# EasyEDA Pro project ProPrj_Inverted_MAML_6x6_2026-08-30.epro, schematic T20F256_FPGA
Create Date: 2026-07-20; Page Name: P1; Project Name: Inverted_MAML_6x6; Schematic Name: Schematic1; Update Date: 2026-07-20; Company: EasyEDA.com; Page Size: A4; Version: V1.0
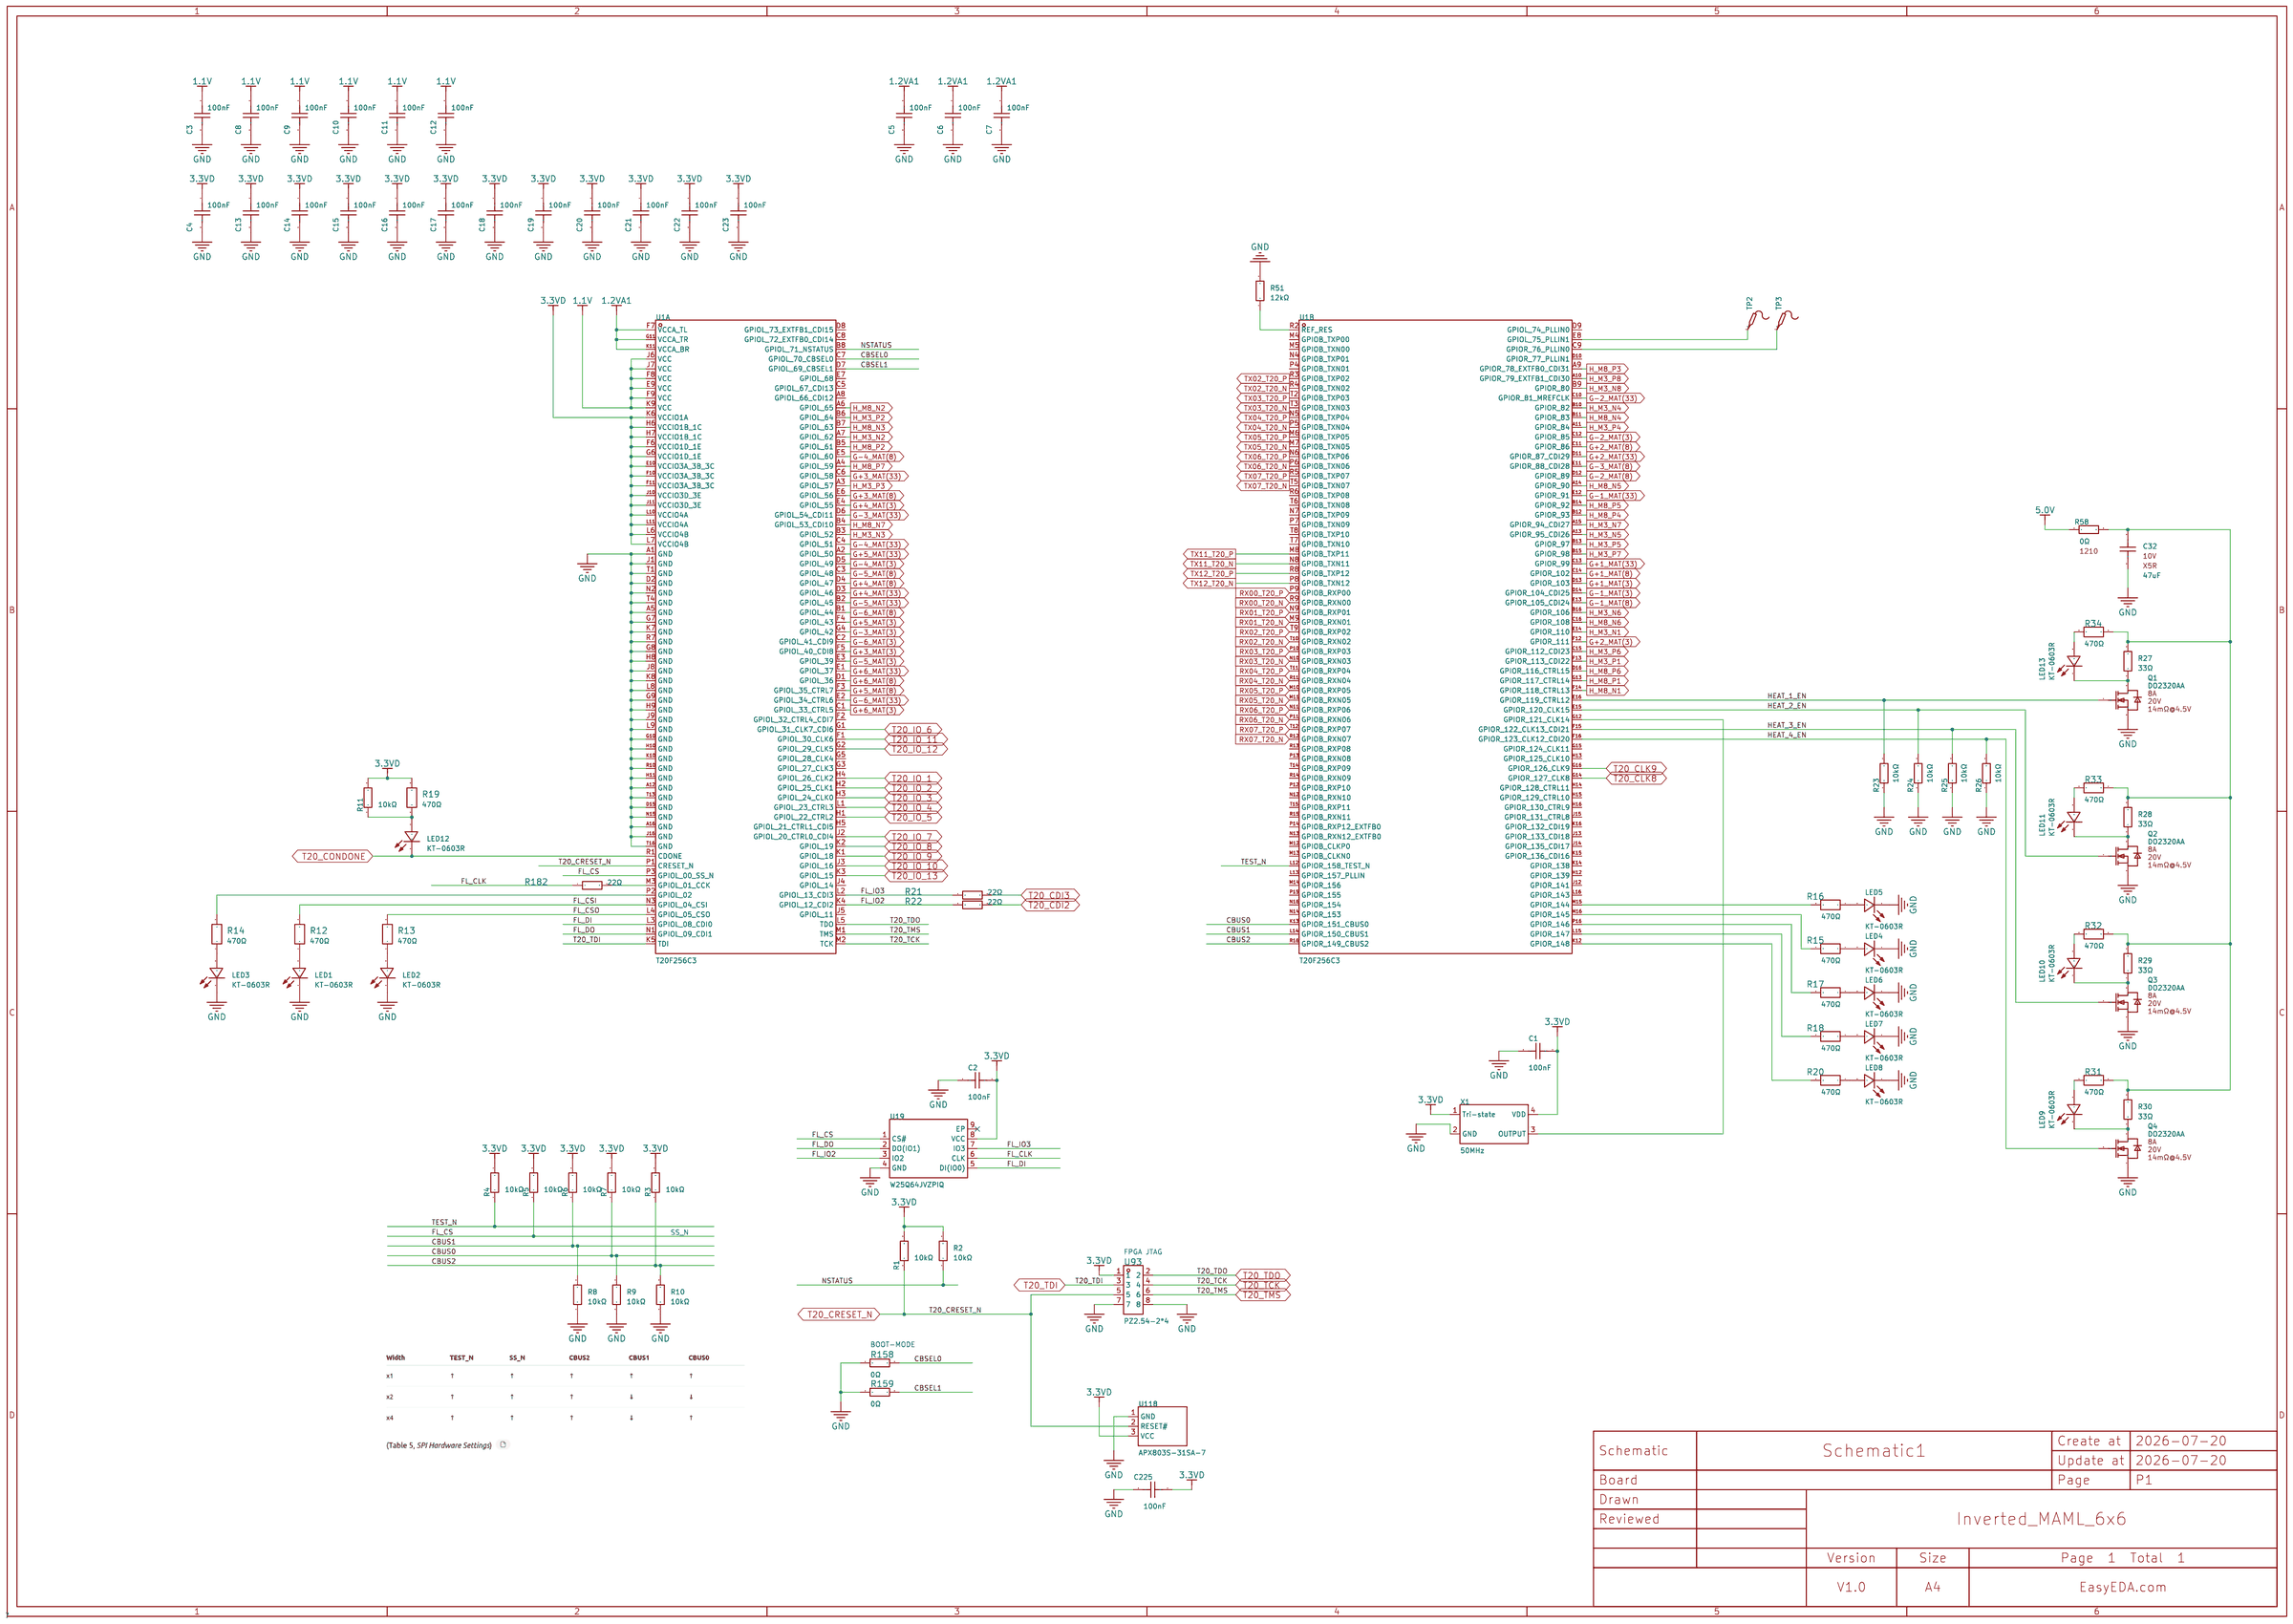
[diagram p0: schematic sheet]

## Parts
C1  100nF  [C0402]
C2  100nF  [C0402]
C3  100nF  [C0201]
C4  100nF  [C0201]
C5  100nF  [C0201]
C6  100nF  [C0201]
C7  100nF  [C0201]
C8  100nF  [C0201]
C9  100nF  [C0201]
C10  100nF  [C0201]
C11  100nF  [C0201]
C12  100nF  [C0201]
C13  100nF  [C0201]
C14  100nF  [C0201]
C15  100nF  [C0201]
C16  100nF  [C0201]
C17  100nF  [C0201]
C18  100nF  [C0201]
C19  100nF  [C0201]
C20  100nF  [C0201]
C21  100nF  [C0201]
C22  100nF  [C0201]
C23  100nF  [C0201]
C32  47uF  [C1206]
C225  100nF  [C0402]
LED1  KT-0603R  [LED0603-RD]
LED2  KT-0603R  [LED0603-RD]
LED3  KT-0603R  [LED0603-RD]
LED4  KT-0603R  [LED0603-RD]
LED5  KT-0603R  [LED0603-RD]
LED6  KT-0603R  [LED0603-RD]
LED7  KT-0603R  [LED0603-RD]
LED8  KT-0603R  [LED0603-RD]
LED9  KT-0603R  [LED0603-RD]
LED10  KT-0603R  [LED0603-RD]
LED11  KT-0603R  [LED0603-RD]
LED12  KT-0603R  [LED0603-RD]
LED13  KT-0603R  [LED0603-RD]
Q1  DO2320AA  [SOT-23-3_L2.9-W1.6-P1.90-LS2.8-BR]
Q2  DO2320AA  [SOT-23-3_L2.9-W1.6-P1.90-LS2.8-BR]
Q3  DO2320AA  [SOT-23-3_L2.9-W1.6-P1.90-LS2.8-BR]
Q4  DO2320AA  [SOT-23-3_L2.9-W1.6-P1.90-LS2.8-BR]
R1  10kΩ  [R0402]
R2  10kΩ  [R0402]
R3  10kΩ  [R0402]
R4  10kΩ  [R0402]
R5  10kΩ  [R0402]
R6  10kΩ  [R0402]
R7  10kΩ  [R0402]
R8  10kΩ  [R0402]  (no BOM)
R9  10kΩ  [R0402]  (no BOM)
R10  10kΩ  [R0402]  (no BOM)
R11  10kΩ  [R0402]
R12  470Ω  [R0402]
R13  470Ω  [R0402]
R14  470Ω  [R0402]
R15  470Ω  [R0402]
R16  470Ω  [R0402]
R17  470Ω  [R0402]
R18  470Ω  [R0402]
R19  470Ω  [R0402]
R20  470Ω  [R0402]
R21  22Ω  [R0402]
R22  22Ω  [R0402]
R23  10kΩ  [R0402]
R24  10kΩ  [R0402]
R25  10kΩ  [R0402]
R26  10kΩ  [R0402]
R27  33Ω  [R2512]
R28  33Ω  [R2512]
R29  33Ω  [R2512]
R30  33Ω  [R2512]
R31  470Ω  [R0402]
R32  470Ω  [R0402]
R33  470Ω  [R0402]
R34  470Ω  [R0402]
R51  12kΩ  [R0402]
R58  0Ω  [R1210]
R158  0Ω  [R0402]
R159  0Ω  [R0402]
R182  22Ω  [R0402]
TP2  -  [Test-Point-0.5mm]
TP3  -  [Test-Point-0.5mm]
U1  T20F256C3  [FBGA-256_L13.0-W13.0-R16-C16-P0.80-TL]  (sections 1,2)
U19  W25Q64JVZPIQ  [WSON-8_L6.0-W5.0-P1.27-BL-EP]
U93  PZ2.54-2*4  [HDR-TH_8P-P2.54-V-M-R2-C4-S2.54]
U118  APX803S-31SA-7  [SOT-23-3_L2.9-W1.3-P1.90-LS2.4-BR]
X1  50MHz  [OSC-SMD_4P-L3.2-W2.5-BL]

## Library data of the parts
C1 C2 C225 = CL05B104KB54PNC: Capacitance: Tolerance:±10% Tolerance:±10% Voltage Rated: Temperature Coefficient:; LCSC Part Name: 100nF ±10% 50V; Supplier Part: C307331; Manufacturer: SAMSUNG(三星); Supplier Footprint: 0402; JLCPCB Part Class: Basic Part; Datasheet: https://atta.szlcsc.com/upload/public/pdf/source/20160218/1457707763339.pdf; Supplier: LCSC; Tolerance: ±10%; Check: true
C3-C23 = CL03A104KP3NNNC: Capacitance:100nF Tolerance:±10% Tolerance:±10% Voltage Rating:10V Temperature Coefficient:X5R; LCSC Part Name: 100nF ±10% 10V; Supplier Part: C49062; Manufacturer: SAMSUNG(三星); Supplier Footprint: 0201; JLCPCB Part Class: Extended Part; Datasheet: https://item.szlcsc.com/datasheet/CL03A104KP3NNNC/50070.html; Supplier: LCSC; Tolerance: ±10%; Voltage Rating: 10V; Temperature Coefficient: X5R
C32 = CL31A476MPHNNNE: Capacitance:47uF Tolerance:±20% Tolerance:±20% Voltage Rating:10V Temperature Coefficient:X5R; LCSC Part Name: 47uF ±20% 10V; Supplier Part: C96123; Manufacturer: SAMSUNG(三星); Supplier Footprint: 1206; JLCPCB Part Class: Basic Part; Datasheet: https://item.szlcsc.com/datasheet/CL31A476MPHNNNE/97327.html; Supplier: LCSC; Tolerance: ±20%; Voltage Rating: 10V; Temperature Coefficient: X5R
LED1-LED13 = KT-0603R: Emitted Color:Red Power Dissipation:- Forward Current:- Dominant Wavelength:- Dominant Wavelength:- Peak Wavelength:- Diode Configuration:- Lens Color:- Color Temperature:- Color Temperature:- Viewing Angle:- Mounting Sytle:- Operating Temperature:-40℃~+8; LCSC Part Name: 0603 红灯 高亮; Supplier Part: C2286; Manufacturer: KENTO; Supplier Footprint: 0603; JLCPCB Part Class: Basic Part; Datasheet: https://atta.szlcsc.com/upload/public/pdf/source/20160616/1466072038404.pdf; Supplier: LCSC; Emitted Color: Red; Operating Temperature: -40℃~+85℃
Q1-Q4 = DO2320AA: Drain to Source Voltage:20V Current - Continuous Drain(Id):8A RDS(on):14mΩ@4.5V Pd - Power Dissipation:1.5W Gate Threshold Voltage (Vgs(th)):1.2V@250uA Gate Charge(Qg):15nC@4.5V Input Capacitance(Ciss):950pF@10V Reverse Transfer Capacitance (Crss@Vds):155; LCSC Part Name: N沟道MOSFET; Supplier Part: C47018574; Manufacturer: DOINGTER(杜因特); Supplier Footprint: SOT-23-3; JLCPCB Part Class: Extended Part; Datasheet: https://item.szlcsc.com/datasheet/DO2320AA/49200340.html; Supplier: LCSC; Drain to Source Voltage: 20V; Current - Continuous Drain(Id): 8A; RDS(on): 14mΩ@4.5V; Pd - Power Dissipation: 1.5W; Gate Threshold Voltage (Vgs(th)): 1.2V@250uA; Gate Charge(Qg): 15nC@4.5V; Input Capacitance(Ciss): 950pF@10V; Reverse Transfer Capacitance (Crss@Vds): 155pF@10V; Operating Temperature: -55℃~+150℃; Type: N-Channel; Output Capacitance(Coss): 175pF
R1-R11 R23-R26 = 0402WGF1002TCE: Type:Thick Film Resistors Resistance:10kΩ Tolerance:±1% Tolerance:±1% Power(Watts): Overload Voltage (Max): Temperature Coefficient:±100ppm/℃ Temperature Coefficient:±100ppm/℃ Operating Temperature Range:-55℃~+155℃ Operating Temperature Range:-55℃~+155℃; LCSC Part Name: 10kΩ ±1% 62.5mW 厚膜电阻; Supplier Part: C25744; Manufacturer: UNI-ROYAL(厚声); Supplier Footprint: 0402; JLCPCB Part Class: Basic Part; Datasheet: https://atta.szlcsc.com/upload/public/pdf/source/20200306/C422600_1E6D84923E4A46A82E41ADD87F860B5C.pdf; Supplier: LCSC; Type: Thick Film Resistors; Tolerance: ±1%; Temperature Coefficient: ±100ppm/℃; Operating Temperature Range: -55℃~+155℃
R12-R20 R31-R34 = 0402WGF4700TCE: Type:Thick Film Resistors Resistance: Tolerance:±1% Tolerance:±1% Power(Watts): Overload Voltage (Max): Temperature Coefficient:±100ppm/℃ Temperature Coefficient:±100ppm/℃ Operating Temperature Range:-55℃~+155℃ Operating Temperature Range:-55℃~+155℃; LCSC Part Name: 470Ω ±1% 62.5mW 厚膜电阻; Supplier Part: C25117; Manufacturer: UNI-ROYAL(厚声); Supplier Footprint: 0402; JLCPCB Part Class: Basic Part; Datasheet: https://atta.szlcsc.com/upload/public/pdf/source/20200306/C422600_1E6D84923E4A46A82E41ADD87F860B5C.pdf; Supplier: LCSC; Type: Thick Film Resistors; Tolerance: ±1%; Temperature Coefficient: ±100ppm/℃; Operating Temperature Range: -55℃~+155℃
R21 R22 R182 = 0402WGF220JTCE: Type:Thick Film Resistors Resistance:22Ω Tolerance:±1% Tolerance:±1% Power(Watts): Overload Voltage (Max): Temperature Coefficient:±100ppm/℃ Temperature Coefficient:±100ppm/℃ Operating Temperature Range:-55℃~+155℃ Operating Temperature Range:-55℃~+155℃; LCSC Part Name: 22Ω ±1% 62.5mW 厚膜电阻; Supplier Part: C25092; Manufacturer: UNI-ROYAL(厚声); Supplier Footprint: 0402; JLCPCB Part Class: Basic Part; Datasheet: https://atta.szlcsc.com/upload/public/pdf/source/20200306/C422600_1E6D84923E4A46A82E41ADD87F860B5C.pdf; Supplier: LCSC; Type: Thick Film Resistors; Tolerance: ±1%; Temperature Coefficient: ±100ppm/℃; Operating Temperature Range: -55℃~+155℃
R27-R30 = CRH2512F33R0E04Z: Type:Thick Film Resistor Resistance:33Ω Tolerance:±1% Tolerance:±1% Power(Watts):2W Voltage-Supply(Max):200V Temperature Coefficient:±100ppm/℃ Temperature Coefficient:±100ppm/℃ Operating Temperature:-55℃~+155℃ Operating Temperature:-55℃~+155℃; LCSC Part Name: 厚膜电阻 33Ω ±1% 2W; Supplier Part: C175260; Manufacturer: EVER OHMS(天二科技); Supplier Footprint: 2512; JLCPCB Part Class: Extended Part; Datasheet: https://item.szlcsc.com/datasheet/CRH2512F33R0E04Z/186650.html; Supplier: LCSC; Type: Thick Film Resistor; Tolerance: ±1%; Power(Watts): 2W; Voltage-Supply(Max): 200V; Temperature Coefficient: ±100ppm/℃; Operating Temperature: -55℃~+155℃
R51 = 0402WGF1202TCE: Type:Thick Film Resistor Resistance:12kΩ Tolerance:±1% Tolerance:±1% Power(Watts):62.5mW Voltage-Supply(Max):50V Temperature Coefficient:±100ppm/℃ Temperature Coefficient:±100ppm/℃ Operating Temperature:-55℃~+155℃ Operating Temperature:-55℃~+155℃; LCSC Part Name: 12kΩ ±1% 62.5mW 厚膜电阻; Supplier Part: C25752; Manufacturer: UNI-ROYAL(厚声); Supplier Footprint: 0402; JLCPCB Part Class: Basic Part; Datasheet: https://item.szlcsc.com/datasheet/0402WGF1202TCE/26495.html; Supplier: LCSC; Type: Thick Film Resistor; Tolerance: ±1%; Power(Watts): 62.5mW; Voltage-Supply(Max): 50V; Temperature Coefficient: ±100ppm/℃; Operating Temperature: -55℃~+155℃
R58 = RS-1210000JT: Type:Thick Film Resistors Resistance:0Ω Tolerance:±5% Tolerance:±5% Power(Watts):1/3W Voltage-Supply(Max):200V Operating Temperature:-55℃~+155℃ Operating Temperature:-55℃~+155℃; LCSC Part Name: 厚膜电阻 0Ω ±5% 333.333mW; Supplier Part: C140000; Manufacturer: FH(风华); Supplier Footprint: 1210; JLCPCB Part Class: Extended Part; Datasheet: https://atta.szlcsc.com/upload/public/pdf/source/20140616/1457707091974.pdf; Supplier: LCSC; Type: Thick Film Resistors; Tolerance: ±5%; Power(Watts): 1/3W; Voltage-Supply(Max): 200V; Operating Temperature: -55℃~+155℃
R158 R159 = 0402WGF0000TCE: Type:Thick Film Resistor Resistance:0Ω Tolerance:±1% Tolerance:±1% Power(Watts):62.5mW Voltage-Supply(Max):50V Temperature Coefficient:±800ppm/℃ Temperature Coefficient:±800ppm/℃ Operating Temperature:-55℃~+155℃ Operating Temperature:-55℃~+155℃; LCSC Part Name: 0Ω ±1% 62.5mW 厚膜电阻; Supplier Part: C17168; Manufacturer: UNI-ROYAL(厚声); Supplier Footprint: 0402; JLCPCB Part Class: Basic Part; Datasheet: https://item.szlcsc.com/datasheet/0402WGF0000TCE/17853.html; Supplier: LCSC; Type: Thick Film Resistor; Tolerance: ±1%; Power(Watts): 62.5mW; Voltage-Supply(Max): 50V; Temperature Coefficient: ±800ppm/℃; Operating Temperature: -55℃~+155℃
TP2 TP3 = Test-Point: Test Point 测试点
U1 = T20F256C3: Type:- Voltage - Supply(VCCIO):- Voltage - Supply(VCCIO):- Number of Logic Elements/Blocks:19728 Logic Array Blocks:- Embedded Block RAM:1069548bit Operating Temperature:0℃~+85℃ Operating Temperature:0℃~+85℃; Supplier Part: C3277960; Manufacturer: Efinix; Supplier Footprint: FBGA-256(13x13); JLCPCB Part Class: Extended Part; Datasheet: https://atta.szlcsc.com/upload/public/pdf/source/231023/trion20-ds-v4.3.pdf-f424e73107ecd1985512a57dd8500c50.pdf; Supplier: LCSC; Number of Logic Elements/Blocks: 19728; Embedded Block RAM: 1069548bit; Operating Temperature: 0℃~+85℃
U19 = W25Q64JVZPIQ: Interface Type:SPI Memory Size:64Mbit Clock Frequency (fc):133MHz Supply Voltage:2.7V~3.6V Supply Voltage:2.7V~3.6V Page Programming Time (Tpp):400us Block Erase Time (tBE):120ms@(32KB) Data Retention - TDR (Year):20 years Operating Temperature:-40℃~+85℃; Supplier Part: C2940197; Manufacturer: WINBOND(华邦); Supplier Footprint: WSON-8-EP(5x6); JLCPCB Part Class: Extended Part; Datasheet: https://atta.szlcsc.com/upload/public/pdf/source/20220111/96C134BA110DAC08742B3CB6C4519B4C.pdf; Supplier: LCSC; Interface Type: SPI; Memory Size: 64Mbit; Clock Frequency (fc): 133MHz; Supply Voltage: 2.7V~3.6V; Page Programming Time (Tpp): 400us; Block Erase Time (tBE): 120ms@(32KB); Data Retention - TDR (Year): 20 years; Operating Temperature: -40℃~+85℃; Check: true
U93 = PZ2.54-2*4: Pin Structure:2x4P Pitch:2.54mm Number of Rows:双排 Number of Pins:8P; Supplier Part: C5156676; Manufacturer: ZHOURI(洲日); Supplier Footprint: 插件,P=2.54mm; JLCPCB Part Class: Extended Part; Datasheet: https://atta.szlcsc.com/upload/public/pdf/source/20220923/0E7A4A94740FFD503E2D73F36F92C1EA.pdf; Supplier: LCSC; Pin Structure: 2x4P; Pitch: 2.54mm; Number of Rows: 双排; Number of Pins: 8P; Check: true
U118 = APX803S-31SA-7: ChipType:Voltage Monitor Output Type:Open Drain Voltage - Supply:1V~5.5V Voltage - Supply:1V~5.5V Reset Active Level:Active Low Threshold Voltage:3.08V Number of Voltages Monitored:1 Manual Reset:No Watchdog:No Reset Timeout:240ms Operating Temperature:-4; LCSC Part Name: 3引脚微处理器复位电路; Supplier Part: C129757; Manufacturer: DIODES(美台); Supplier Footprint: SOT-23; JLCPCB Part Class: Extended Part; Datasheet: https://item.szlcsc.com/datasheet/APX803S-31SA-7/141043.html; Supplier: LCSC; ChipType: Voltage Monitor; Output Type: Open Drain; Voltage - Supply: 1V~5.5V; Reset Active Level: Active Low; Threshold Voltage: 3.08V; Number of Voltages Monitored: 1; Manual Reset: No; Watchdog: No; Reset Timeout: 240ms; Operating Temperature: -40℃~+85℃
X1 = OT322550MJBA4SL: Frequency:50MHz Normal temperature Frequency Tolerance:±10ppm Normal temperature Frequency Tolerance:±10ppm Output Type:CMOS Voltage - Supply:1.8V~3.3V Voltage - Supply:1.8V~3.3V Frequency Stability:±20ppm Frequency Stability:±20ppm Operating Temperature:; LCSC Part Name: YSO110TR 50MHZ 4P 3225 1.8V-3.3V ±10PPM -40~85℃ (±20PPM) CMOS; Supplier Part: C717684; Manufacturer: YXC(扬兴晶振); Supplier Footprint: SMD3225-4P; JLCPCB Part Class: Extended Part; Datasheet: https://item.szlcsc.com/datasheet/OT322550MJBA4SL/758644.html; Supplier: LCSC; Normal temperature Frequency Tolerance: ±10ppm; Output Type: CMOS; Voltage - Supply: 1.8V~3.3V; Frequency Stability: ±20ppm; Operating Temperature: -40℃~+85℃

## Nets
1.1V: C3.1 C8.1 C9.1 C10.1 C11.1 C12.1 U1.E9(VCC) U1.F8(VCC) U1.F9(VCC) U1.J6(VCC) U1.J7(VCC) U1.K9(VCC)
1.2VA1: C5.1 C6.1 C7.1 U1.F7(VCCA_TL) U1.G11(VCCA_TR) U1.K11(VCCA_BR)
3.3VD: C1.1 C2.1 C4.1 C13.1 C14.1 C15.1 C16.1 C17.1 C18.1 C19.1 C20.1 C21.1 C22.1 C23.1 C225.1 R1.2 R2.2 R3.2 R4.2 R5.2 R6.2 R7.2 R11.2 R19.2 U1.E10(VCCIO3A_3B_3C) U1.F6(VCCIO1D_1E) U1.F10(VCCIO3A_3B_3C) U1.F11(VCCIO3A_3B_3C) U1.G6(VCCIO1D_1E) U1.H6(VCCIO1B_1C) U1.H7(VCCIO1B_1C) U1.J10(VCCIO3D_3E) U1.J11(VCCIO3D_3E) U1.K6(VCCIO1A) U1.L6(VCCIO4B) U1.L7(VCCIO4B) U1.L10(VCCIO4A) U1.L11(VCCIO4A) U19.8(VCC) U93.1 U118.3(VCC) X1.1(Tri-state) X1.4(VDD)
5.0V: R58.1
GND: C1.2 C2.2 C3.2 C4.2 C5.2 C6.2 C7.2 C8.2 C9.2 C10.2 C11.2 C12.2 C13.2 C14.2 C15.2 C16.2 C17.2 C18.2 C19.2 C20.2 C21.2 C22.2 C23.2 C32.1 C225.2 LED1.1(K) LED2.1(K) LED3.1(K) LED4.1(K) LED5.1(K) LED6.1(K) LED7.1(K) LED8.1(K) Q1.2(S) Q2.2(S) Q3.2(S) Q4.2(S) R8.1 R9.1 R10.1 R23.1 R24.1 R25.1 R26.1 R51.2 R158.1 R159.1 U1.A1(GND) U1.A5(GND) U1.A12(GND) U1.A16(GND) U1.D2(GND) U1.D15(GND) U1.G7(GND) U1.G8(GND) U1.G9(GND) U1.G10(GND) U1.H8(GND) U1.H9(GND) U1.H10(GND) U1.H11(GND) U1.J1(GND) U1.J8(GND) U1.J9(GND) U1.J16(GND) U1.K7(GND) U1.K8(GND) U1.K10(GND) U1.L8(GND) U1.L9(GND) U1.N2(GND) U1.N15(GND) U1.R7(GND) U1.R10(GND) U1.T1(GND) U1.T4(GND) U1.T13(GND) U1.T16(GND) U19.4(GND) U93.7 U93.8 U118.1(GND) X1.2(GND)
CBSEL0: R158.2 U1.C7(GPIOL_70_CBSEL0)
CBSEL1: R159.2 U1.D7(GPIOL_69_CBSEL1)
CBUS0: R7.1 R9.2 U1.K13(GPIOR_151_CBUS0)
CBUS1: R6.1 R8.2 U1.L14(GPIOR_150_CBUS1)
CBUS2: R3.1 R10.2 U1.R16(GPIOR_149_CBUS2)
FL_CLK: R182.1 U19.6(CLK)
FL_CS: R5.1 U1.P3(GPIOL_00_SS_N) U19.1(CS#)
FL_CSI: R12.2 U1.N3(GPIOL_04_CSI)
FL_CSO: R13.2 U1.L4(GPIOL_05_CSO)
FL_DI: U1.L3(GPIOL_08_CDI0) U19.5(DI(IO0))
FL_DO: U1.N1(GPIOL_09_CDI1) U19.2(DO(IO1))
FL_IO2: R22.1 U1.K4(GPIOL_12_CDI2) U19.3(IO2)
FL_IO3: R21.1 U1.L2(GPIOL_13_CDI3) U19.7(IO3)
G+1_MAT(3): U1.D13(GPIOR_103)
G+1_MAT(8): U1.C14(GPIOR_102)
G+1_MAT(33): U1.C13(GPIOR_99)
G+2_MAT(3): U1.F12(GPIOR_111)
G+2_MAT(8): U1.C11(GPIOR_86)
G+2_MAT(33): U1.D11(GPIOR_87_CDI29)
G+3_MAT(3): U1.F5(GPIOL_40_CDI8)
G+3_MAT(8): U1.E6(GPIOL_56)
G+3_MAT(33): U1.C6(GPIOL_58)
G+4_MAT(3): U1.E4(GPIOL_55)
G+4_MAT(8): U1.D4(GPIOL_47)
G+4_MAT(33): U1.D3(GPIOL_46)
G+5_MAT(3): U1.F4(GPIOL_43)
G+5_MAT(8): U1.F3(GPIOL_35_CTRL7)
G+5_MAT(33): U1.A2(GPIOL_50)
G+6_MAT(3): U1.C1(GPIOL_33_CTRL5)
G+6_MAT(8): U1.D1(GPIOL_36)
G+6_MAT(33): U1.E1(GPIOL_37)
G-1_MAT(3): U1.D14(GPIOR_104_CDI25)
G-1_MAT(8): U1.E13(GPIOR_105_CDI24)
G-1_MAT(33): U1.E12(GPIOR_91)
G-2_MAT(3): U1.C12(GPIOR_85)
G-2_MAT(8): U1.D12(GPIOR_89)
G-2_MAT(33): U1.C10(GPIOR_81_MREFCLK)
G-3_MAT(3): U1.G4(GPIOL_42)
G-3_MAT(8): U1.E11(GPIOR_88_CDI28)
G-3_MAT(33): U1.D6(GPIOL_54_CDI11)
G-4_MAT(3): U1.D5(GPIOL_49)
G-4_MAT(8): U1.E5(GPIOL_60)
G-4_MAT(33): U1.C4(GPIOL_51)
G-5_MAT(3): U1.E3(GPIOL_39)
G-5_MAT(8): U1.C3(GPIOL_48)
G-5_MAT(33): U1.B2(GPIOL_45)
G-6_MAT(3): U1.C2(GPIOL_41_CDI9)
G-6_MAT(8): U1.B1(GPIOL_44)
G-6_MAT(33): U1.E2(GPIOL_34_CTRL6)
H_M3_N1: U1.E14(GPIOR_110)
H_M3_N2: U1.A7(GPIOL_62)
H_M3_N3: U1.B3(GPIOL_52)
H_M3_N4: U1.B10(GPIOR_82)
H_M3_N5: U1.A13(GPIOR_95_CDI26)
H_M3_N6: U1.B16(GPIOR_106)
H_M3_N7: U1.A15(GPIOR_94_CDI27)
H_M3_N8: U1.B9(GPIOR_80)
H_M3_P1: U1.F13(GPIOR_113_CDI22)
H_M3_P2: U1.B6(GPIOL_64)
H_M3_P3: U1.A3(GPIOL_57)
H_M3_P4: U1.A11(GPIOR_84)
H_M3_P5: U1.B13(GPIOR_97)
H_M3_P6: U1.C15(GPIOR_112_CDI23)
H_M3_P7: U1.B15(GPIOR_98)
H_M3_P8: U1.A10(GPIOR_79_EXTFB1_CDI30)
H_M8_N1: U1.F14(GPIOR_118_CTRL13)
H_M8_N2: U1.A6(GPIOL_65)
H_M8_N3: U1.B7(GPIOL_63)
H_M8_N4: U1.B11(GPIOR_83)
H_M8_N5: U1.A14(GPIOR_90)
H_M8_N6: U1.C16(GPIOR_108)
H_M8_N7: U1.B4(GPIOL_53_CDI10)
H_M8_P1: U1.G13(GPIOR_117_CTRL14)
H_M8_P2: U1.B5(GPIOL_61)
H_M8_P3: U1.A9(GPIOR_78_EXTFB0_CDI31)
H_M8_P4: U1.B12(GPIOR_93)
H_M8_P5: U1.B14(GPIOR_92)
H_M8_P6: U1.D16(GPIOR_116_CTRL15)
H_M8_P7: U1.A4(GPIOL_59)
HEAT_1_EN: Q1.1(G) R23.2 U1.E16(GPIOR_119_CTRL12)
HEAT_2_EN: Q2.1(G) R24.2 U1.E15(GPIOR_120_CLK15)
HEAT_3_EN: Q3.1(G) R25.2 U1.F15(GPIOR_122_CLK13_CDI21)
HEAT_4_EN: Q4.1(G) R26.2 U1.F16(GPIOR_123_CLK12_CDI20)
NSTATUS: R2.1 U1.B8(GPIOL_71_NSTATUS)
RX00_T20_N: U1.R9(GPIOB_RXN00)
RX00_T20_P: U1.P9(GPIOB_RXP00)
RX01_T20_N: U1.M9(GPIOB_RXN01)
RX01_T20_P: U1.N9(GPIOB_RXP01)
RX02_T20_N: U1.T10(GPIOB_RXN02)
RX02_T20_P: U1.T9(GPIOB_RXP02)
RX03_T20_N: U1.N10(GPIOB_RXN03)
RX03_T20_P: U1.P10(GPIOB_RXP03)
RX04_T20_N: U1.R11(GPIOB_RXN04)
RX04_T20_P: U1.T11(GPIOB_RXP04)
RX05_T20_N: U1.M11(GPIOB_RXN05)
RX05_T20_P: U1.M10(GPIOB_RXP05)
RX06_T20_N: U1.P11(GPIOB_RXN06)
RX06_T20_P: U1.N11(GPIOB_RXP06)
RX07_T20_N: U1.R12(GPIOB_RXN07)
RX07_T20_P: U1.T12(GPIOB_RXP07)
T20_CDI2: R22.2
T20_CDI3: R21.2
T20_CLK8: U1.G14(GPIOR_127_CLK8)
T20_CLK9: U1.G16(GPIOR_126_CLK9)
T20_CONDONE: LED12.1(K) U1.R1(CDONE)
T20_CRESET_N: R1.1 U1.P1(CRESET_N) U93.5 U118.2(RESET#)
T20_IO_1: U1.H4(GPIOL_26_CLK2)
T20_IO_2: U1.H2(GPIOL_25_CLK1)
T20_IO_3: U1.H3(GPIOL_24_CLK0)
T20_IO_4: U1.L1(GPIOL_23_CTRL3)
T20_IO_5: U1.H1(GPIOL_22_CTRL2)
T20_IO_6: U1.G1(GPIOL_31_CLK7_CDI6)
T20_IO_7: U1.J2(GPIOL_20_CTRL0_CDI4)
T20_IO_8: U1.K2(GPIOL_19)
T20_IO_9: U1.K1(GPIOL_18)
T20_IO_10: U1.J3(GPIOL_16)
T20_IO_11: U1.F1(GPIOL_30_CLK6)
T20_IO_12: U1.G2(GPIOL_29_CLK5)
T20_IO_13: U1.K3(GPIOL_15)
T20_TCK: U1.M2(TCK) U93.4
T20_TDI: U1.K5(TDI) U93.3
T20_TDO: U1.L5(TDO) U93.2
T20_TMS: U1.M1(TMS) U93.6
TEST_N: R4.1 U1.L12(GPIOR_158_TEST_N)
TX02_T20_N: U1.R4(GPIOB_TXN02)
TX02_T20_P: U1.R3(GPIOB_TXP02)
TX03_T20_N: U1.T3(GPIOB_TXN03)
TX03_T20_P: U1.T2(GPIOB_TXP03)
TX04_T20_N: U1.P5(GPIOB_TXN04)
TX04_T20_P: U1.N5(GPIOB_TXP04)
TX05_T20_N: U1.M7(GPIOB_TXN05)
TX05_T20_P: U1.M6(GPIOB_TXP05)
TX06_T20_N: U1.P6(GPIOB_TXN06)
TX06_T20_P: U1.N6(GPIOB_TXP06)
TX07_T20_N: U1.T5(GPIOB_TXN07)
TX07_T20_P: U1.R5(GPIOB_TXP07)
TX11_T20_N: U1.N8(GPIOB_TXN11)
TX11_T20_P: U1.M8(GPIOB_TXP11)
TX12_T20_N: U1.P8(GPIOB_TXN12)
TX12_T20_P: U1.R8(GPIOB_TXP12)
Net-(C32-2): C32.2 R27.2 R28.2 R29.2 R30.2 R31.1 R32.1 R33.1 R34.1 R58.2
Net-(LED1-2): LED1.2(A) R12.1
Net-(LED2-2): LED2.2(A) R13.1
Net-(LED3-2): LED3.2(A) R14.1
Net-(LED4-2): LED4.2(A) R15.1
Net-(LED5-2): LED5.2(A) R16.1
Net-(LED6-2): LED6.2(A) R17.1
Net-(LED7-2): LED7.2(A) R18.1
Net-(LED8-2): LED8.2(A) R20.1
Net-(LED9-1): LED9.1(K) Q4.3(D) R30.1
Net-(LED9-2): LED9.2(A) R31.2
Net-(LED10-1): LED10.1(K) Q3.3(D) R29.1
Net-(LED10-2): LED10.2(A) R32.2
Net-(LED11-1): LED11.1(K) Q2.3(D) R28.1
Net-(LED11-2): LED11.2(A) R33.2
Net-(LED12-2): LED12.2(A) R11.1 R19.1
Net-(LED13-1): LED13.1(K) Q1.3(D) R27.1
Net-(LED13-2): LED13.2(A) R34.2
Net-(R14-2): R14.2 U1.P2(GPIOL_02)
Net-(R15-2): R15.2 U1.M16(GPIOR_145)
Net-(R16-2): R16.2 U1.M15(GPIOR_144)
Net-(R17-2): R17.2 U1.P16(GPIOR_146)
Net-(R18-2): R18.2 U1.L15(GPIOR_147)
Net-(R20-2): R20.2 U1.K12(GPIOR_148)
Net-(R51-1): R51.1 U1.R2(REF_RES)
Net-(R182-2): R182.2 U1.M3(GPIOL_01_CCK)
Net-(TP2-1): TP2.1 U1.E8(GPIOL_75_PLLIN1)
Net-(TP3-1): TP3.1 U1.C9(GPIOR_76_PLLIN0)
Net-(U1-G12): U1.G12(GPIOR_121_CLK14) X1.3(OUTPUT)

Not connected (* = marked no-connect by the designer): U1 A8(GPIOL_66_CDI12) C5(GPIOL_67_CDI13) C8(GPIOL_72_EXTFB0_CDI14) D8(GPIOL_73_EXTFB1_CDI15) D9(GPIOL_74_PLLIN0) D10(GPIOR_77_PLLIN1) E7(GPIOL_68) F2(GPIOL_32_CTRL4_CDI7) G3(GPIOL_27_CLK3) G5(GPIOL_28_CLK4) G15(GPIOR_124_CLK11) H5(GPIOL_21_CTRL1_CDI5) H12(GPIOR_139) H13(GPIOR_125_CLK10) H14(GPIOR_128_CTRL11) H15(GPIOR_129_CTRL10) H16(GPIOR_130_CTRL9) J4(GPIOL_14) J5(GPIOL_11) J12(GPIOR_141) J13(GPIOR_133_CDI18) J14(GPIOR_135_CDI17) J15(GPIOR_131_CTRL8) K14(GPIOR_138) K15(GPIOR_136_CDI16) K16(GPIOR_132_CDI19) L13(GPIOR_157_PLLIN) L16(GPIOR_143) M4(GPIOB_TXP00) M5(GPIOB_TXN00) M12(GPIOB_CLKP0) M13(GPIOB_CLKN0) M14(GPIOR_156) N4(GPIOB_TXP01) N7(GPIOB_TXP09) N12(GPIOB_RXN10) N13(GPIOB_RXN12_EXTFB0) N14(GPIOR_153) N16(GPIOR_154) P4(GPIOB_TXN01) P7(GPIOB_TXN09) P12(GPIOB_RXP10) P13(GPIOB_RXN08) P14(GPIOB_RXP12_EXTFB0) P15(GPIOR_155) R6(GPIOB_TXP08) R13(GPIOB_RXP08) R14(GPIOB_RXN09) R15(GPIOB_RXN11) T6(GPIOB_TXN08) T7(GPIOB_TXN10) T8(GPIOB_TXP10) T14(GPIOB_RXP09) T15(GPIOB_RXP11); U19 9(EP)*

## Notes on the sheet
- SS_N
- FPGA JTAG
- BOOT-MODE
